# Altium schematic sheet Sheet1.SchDoc
size 420 x 297 mm; Scale: None
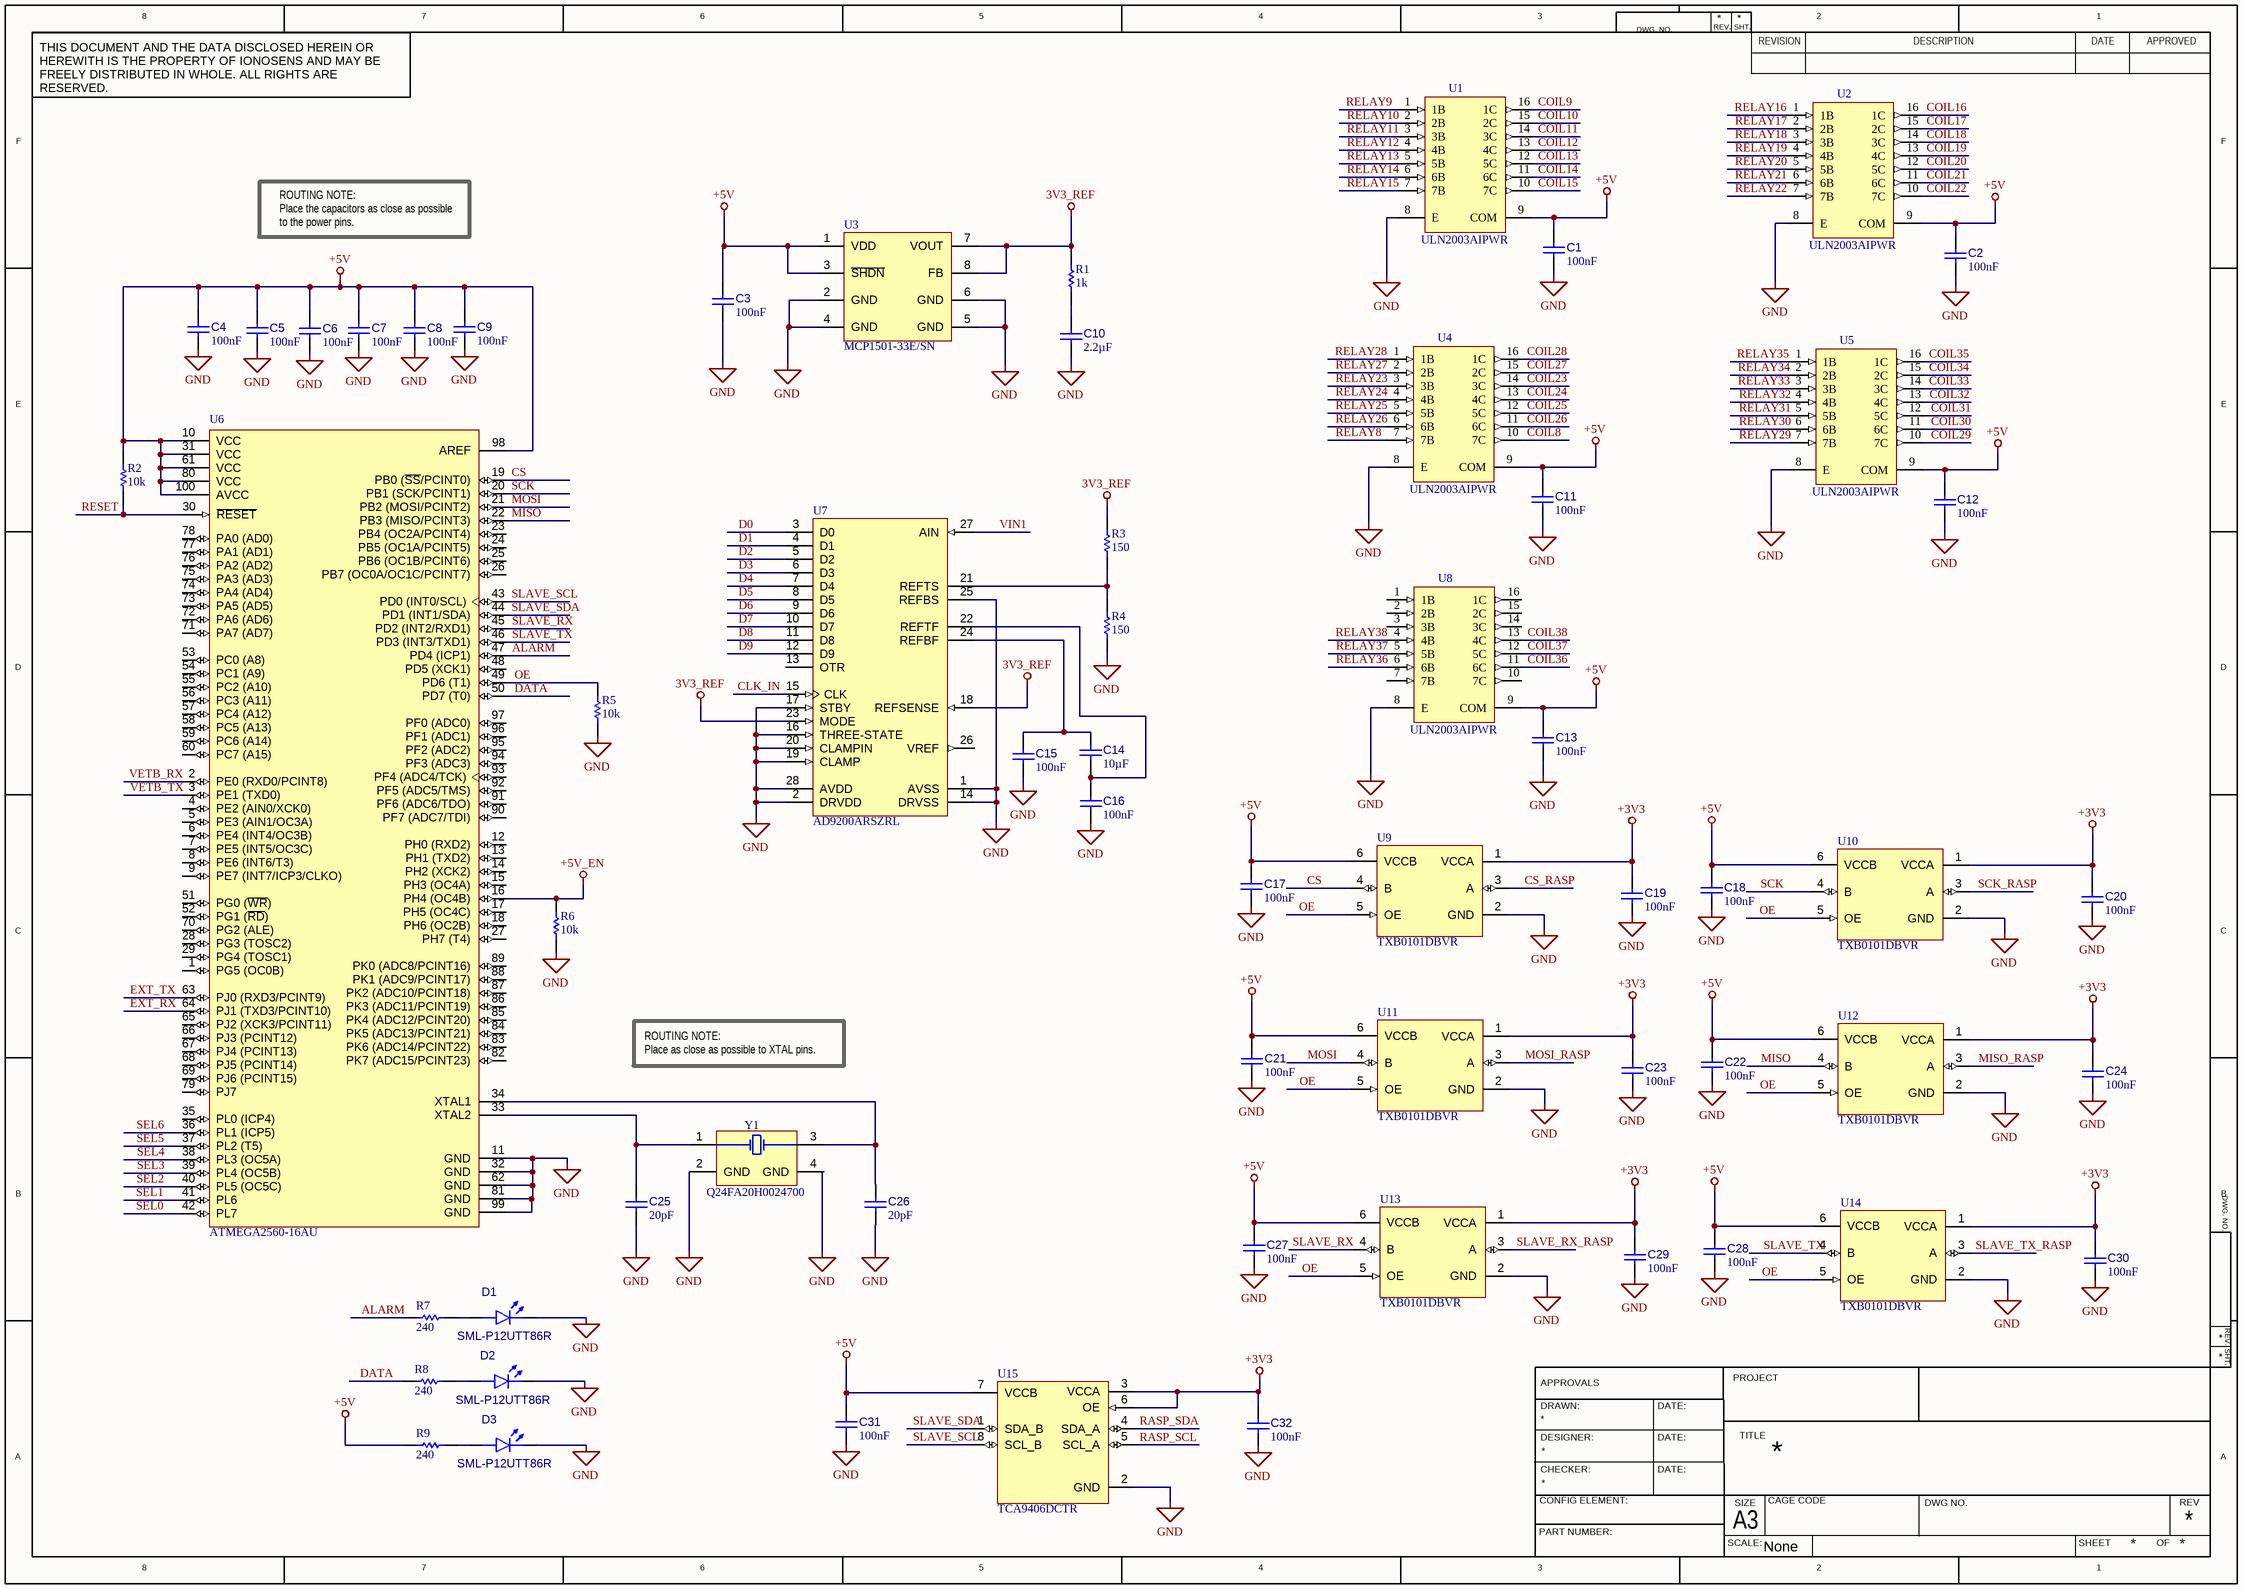
[diagram p0: Sheet1.SchDoc]

## Parts
C1  value 100nF  [CAPC1005X06M]  (hidden comment: CC0402JRX7R7BB104)
C2  value 100nF  [CAPC1005X06M]  (hidden comment: CC0402JRX7R7BB104)
C3  value 100nF  [CAPC1005X06M]  (hidden comment: CC0402JRX7R7BB104)
C4  value 100nF  [CAPC1005X06M]  (hidden comment: CC0402JRX7R7BB104)
C5  value 100nF  [CAPC1005X06M]  (hidden comment: CC0402JRX7R7BB104)
C6  value 100nF  [CAPC1005X06M]  (hidden comment: CC0402JRX7R7BB104)
C7  value 100nF  [CAPC1005X06M]  (hidden comment: CC0402JRX7R7BB104)
C8  value 100nF  [CAPC1005X06M]  (hidden comment: CC0402JRX7R7BB104)
C9  value 100nF  [CAPC1005X06M]  (hidden comment: CC0402JRX7R7BB104)
C10  value 2.2µF  [CAPC2012X14M]  (hidden comment: AC0805KKX7R8BB225)
C11  value 100nF  [CAPC1005X06M]  (hidden comment: CC0402JRX7R7BB104)
C12  value 100nF  [CAPC1005X06M]  (hidden comment: CC0402JRX7R7BB104)
C13  value 100nF  [CAPC1005X06M]  (hidden comment: CC0402JRX7R7BB104)
C14  value 10µF  [CAPC1005X07N]  (hidden comment: CC0402MRX5R6BB106)
C15  value 100nF  [CAPC1005X06M]  (hidden comment: CC0402JRX7R7BB104)
C16  value 100nF  [CAPC1005X06M]  (hidden comment: CC0402JRX7R7BB104)
C17  value 100nF  [CAPC1005X06M]  (hidden comment: CC0402JRX7R7BB104)
C18  value 100nF  [CAPC1005X06M]  (hidden comment: CC0402JRX7R7BB104)
C19  value 100nF  [CAPC1005X06M]  (hidden comment: CC0402JRX7R7BB104)
C20  value 100nF  [CAPC1005X06M]  (hidden comment: CC0402JRX7R7BB104)
C21  value 100nF  [CAPC1005X06M]  (hidden comment: CC0402JRX7R7BB104)
C22  value 100nF  [CAPC1005X06M]  (hidden comment: CC0402JRX7R7BB104)
C23  value 100nF  [CAPC1005X06M]  (hidden comment: CC0402JRX7R7BB104)
C24  value 100nF  [CAPC1005X06M]  (hidden comment: CC0402JRX7R7BB104)
C25  value 20pF  [CAPC1005X06M]  (hidden comment: CC0402JRNPO9BN200)
C26  value 20pF  [CAPC1005X06M]  (hidden comment: CC0402JRNPO9BN200)
C27  value 100nF  [CAPC1005X06M]  (hidden comment: CC0402JRX7R7BB104)
C28  value 100nF  [CAPC1005X06M]  (hidden comment: CC0402JRX7R7BB104)
C29  value 100nF  [CAPC1005X06M]  (hidden comment: CC0402JRX7R7BB104)
C30  value 100nF  [CAPC1005X06M]  (hidden comment: CC0402JRX7R7BB104)
C31  value 100nF  [CAPC1005X06M]  (hidden comment: CC0402JRX7R7BB104)
C32  value 100nF  [CAPC1005X06M]  (hidden comment: CC0402JRX7R7BB104)
D1  SML-P12UTT86R  [DIOC1005X02R]
D2  SML-P12UTT86R  [DIOC1005X02R]
D3  SML-P12UTT86R  [DIOC1005X02R]
R1  value 1k  [RESC1005X04M]  (hidden comment: AC0402FR-071KL)
R2  value 10k  [RESC1005X04M]  (hidden comment: AC0402FR-0710KL)
R3  value 150  [RESC1608X06N]  (hidden comment: AC0603FR-07150RL)
R4  value 150  [RESC1608X06N]  (hidden comment: AC0603FR-07150RL)
R5  value 10k  [RESC1005X04M]  (hidden comment: AC0402FR-0710KL)
R6  value 10k  [RESC1005X04M]  (hidden comment: AC0402FR-0710KL)
R7  value 240  [RESC1005X04M]  (hidden comment: AC0402FR-07240RL)
R8  value 240  [RESC1005X04M]  (hidden comment: AC0402FR-07240RL)
R9  value 240  [RESC1005X04M]  (hidden comment: AC0402FR-07240RL)
U1  ULN2003AIPWR  [TSOP65P640X120-16M]
U2  ULN2003AIPWR  [TSOP65P640X120-16M]
U3  MCP1501-33E/SN  [SOIC127P600X175-8M]
U4  ULN2003AIPWR  [TSOP65P640X120-16M]
U5  ULN2003AIPWR  [TSOP65P640X120-16M]
U6  ATMEGA2560-16AU  [ATML-100A_M]
U7  AD9200ARSZRL  [SOP65P780X198-28N]
U8  ULN2003AIPWR  [TSOP65P640X120-16M]
U9  TXB0101DBVR  [SOT95P280X145-6M]
U10  TXB0101DBVR  [SOT95P280X145-6M]
U11  TXB0101DBVR  [SOT95P280X145-6M]
U12  TXB0101DBVR  [SOT95P280X145-6M]
U13  TXB0101DBVR  [SOT95P280X145-6M]
U14  TXB0101DBVR  [SOT95P280X145-6M]
U15  TCA9406DCTR  [TSOP65P400X130-8M]
Y1  Q24FA20H0024700  [FA-20H]

## Nets
3V3_REF: R1.2 R3.2 U3.7(VOUT) U3.8(FB) U7.18(REFSENSE) U7.23(MODE)
+3V3: C19.2 C20.2 C23.2 C24.2 C29.2 C30.2 C32.2 U9.1(VCCA) U10.1(VCCA) U11.1(VCCA) U12.1(VCCA) U13.1(VCCA) U14.1(VCCA) U15.3(VCCA) U15.6(OE)
+5V: C1.2 C2.2 C3.2 C4.2 C5.2 C6.2 C7.2 C8.2 C9.2 C11.2 C12.2 C13.2 C17.2 C18.2 C21.2 C22.2 C27.2 C28.2 C31.2 R2.2 R9.1 U1.9(COM) U2.9(COM) U3.1(VDD) U3.3(~{SHDN}) U4.9(COM) U5.9(COM) U6.10(VCC) U6.31(VCC) U6.61(VCC) U6.80(VCC) U6.98(AREF) U6.100(AVCC) U8.9(COM) U9.6(VCCB) U10.6(VCCB) U11.6(VCCB) U12.6(VCCB) U13.6(VCCB) U14.6(VCCB) U15.7(VCCB)
+5V_EN: R6.2 U6.16(PH4_(OC4B))
GND: C1.1 C2.1 C3.1 C4.1 C5.1 C6.1 C7.1 C8.1 C9.1 C10.1 C11.1 C12.1 C13.1 C15.1 C16.1 C17.1 C18.1 C19.1 C20.1 C21.1 C22.1 C23.1 C24.1 C25.1 C26.1 C27.1 C28.1 C29.1 C30.1 C31.1 C32.1 D1.1(K) D2.1(K) D3.1(K) R4.1 R5.1 R6.1 U1.8(E) U2.8(E) U3.2(GND) U3.4(GND) U3.5(GND) U3.6(GND) U4.8(E) U5.8(E) U6.11(GND) U6.32(GND) U6.62(GND) U6.81(GND) U6.99(GND) U7.1(AVSS) U7.2(DRVDD) U7.14(DRVSS) U7.16(THREE-STATE) U7.17(STBY) U7.19(CLAMP) U7.20(CLAMPIN) U7.25(REFBS) U7.28(AVDD) U8.8(E) U9.2(GND) U10.2(GND) U11.2(GND) U12.2(GND) U13.2(GND) U14.2(GND) U15.2(GND) Y1.2(GND) Y1.4(GND)
ALARM: R7.1 U6.47(PD4_(ICP1))
CLK_IN: U7.15(CLK)
COIL8: U4.10(7C)
COIL9: U1.16(1C)
COIL10: U1.15(2C)
COIL11: U1.14(3C)
COIL12: U1.13(4C)
COIL13: U1.12(5C)
COIL14: U1.11(6C)
COIL15: U1.10(7C)
COIL16: U2.16(1C)
COIL17: U2.15(2C)
COIL18: U2.14(3C)
COIL19: U2.13(4C)
COIL20: U2.12(5C)
COIL21: U2.11(6C)
COIL22: U2.10(7C)
COIL23: U4.14(3C)
COIL24: U4.13(4C)
COIL25: U4.12(5C)
COIL26: U4.11(6C)
COIL27: U4.15(2C)
COIL28: U4.16(1C)
COIL29: U5.10(7C)
COIL30: U5.11(6C)
COIL31: U5.12(5C)
COIL32: U5.13(4C)
COIL33: U5.14(3C)
COIL34: U5.15(2C)
COIL35: U5.16(1C)
COIL36: U8.11(6C)
COIL37: U8.12(5C)
COIL38: U8.13(4C)
CS: U6.19(PB0_(~{SS}/PCINT0)) U9.4(B)
CS_RASP: U9.3(A)
D0: U7.3(D0)
D1: U7.4(D1)
D2: U7.5(D2)
D3: U7.6(D3)
D4: U7.7(D4)
D5: U7.8(D5)
D6: U7.9(D6)
D7: U7.10(D7)
D8: U7.11(D8)
D9: U7.12(D9)
DATA: R8.1 U6.50(PD7_(T0))
EXT_RX: U6.64(PJ1_(TXD3/PCINT10))
EXT_TX: U6.63(PJ0_(RXD3/PCINT9))
MISO: U6.22(PB3_(MISO/PCINT3)) U12.4(B)
MISO_RASP: U12.3(A)
MOSI: U6.21(PB2_(MOSI/PCINT2)) U11.4(B)
MOSI_RASP: U11.3(A)
OE: R5.2 U6.49(PD6_(T1)) U9.5(OE) U10.5(OE) U11.5(OE) U12.5(OE) U13.5(OE) U14.5(OE)
RASP_SCL: U15.5(SCL_A)
RASP_SDA: U15.4(SDA_A)
RELAY8: U4.7(7B)
RELAY9: U1.1(1B)
RELAY10: U1.2(2B)
RELAY11: U1.3(3B)
RELAY12: U1.4(4B)
RELAY13: U1.5(5B)
RELAY14: U1.6(6B)
RELAY15: U1.7(7B)
RELAY16: U2.1(1B)
RELAY17: U2.2(2B)
RELAY18: U2.3(3B)
RELAY19: U2.4(4B)
RELAY20: U2.5(5B)
RELAY21: U2.6(6B)
RELAY22: U2.7(7B)
RELAY23: U4.3(3B)
RELAY24: U4.4(4B)
RELAY25: U4.5(5B)
RELAY26: U4.6(6B)
RELAY27: U4.2(2B)
RELAY28: U4.1(1B)
RELAY29: U5.7(7B)
RELAY30: U5.6(6B)
RELAY31: U5.5(5B)
RELAY32: U5.4(4B)
RELAY33: U5.3(3B)
RELAY34: U5.2(2B)
RELAY35: U5.1(1B)
RELAY36: U8.6(6B)
RELAY37: U8.5(5B)
RELAY38: U8.4(4B)
RESET: R2.1 U6.30(~{RESET})
SCK: U6.20(PB1_(SCK/PCINT1)) U10.4(B)
SCK_RASP: U10.3(A)
SEL0: U6.42(PL7)
SEL1: U6.41(PL6)
SEL2: U6.40(PL5_(OC5C))
SEL3: U6.39(PL4_(OC5B))
SEL4: U6.38(PL3_(OC5A))
SEL5: U6.37(PL2_(T5))
SEL6: U6.36(PL1_(ICP5))
SLAVE_RX: U6.45(PD2_(INT2/RXD1)) U13.4(B)
SLAVE_RX_RASP: U13.3(A)
SLAVE_SCL: U6.43(PD0_(INT0/SCL)) U15.8(SCL_B)
SLAVE_SDA: U6.44(PD1_(INT1/SDA)) U15.1(SDA_B)
SLAVE_TX: U6.46(PD3_(INT3/TXD1)) U14.4(B)
SLAVE_TX_RASP: U14.3(A)
VETB_RX: U6.2(PE0_(RXD0/PCINT8))
VETB_TX: U6.3(PE1_(TXD0))
VIN1: U7.27(AIN)
NetC10_2: C10.2 R1.1
NetC14_1: C14.1 C16.2 U7.22(REFTF)
NetC14_2: C14.2 C15.2 U7.24(REFBF)
NetC25_2: C25.2 U6.33(XTAL2) Y1.1(X1)
NetC26_2: C26.2 U6.34(XTAL1) Y1.3(X2)
NetD1_2: D1.2(A) R7.2
NetD2_2: D2.2(A) R8.2
NetD3_2: D3.2(A) R9.2
NetR3_1: R3.1 R4.2 U7.21(REFTS)

Not connected (* = marked no-connect by the designer): U6 1(PG5_(OC0B)) 4(PE2_(AIN0/XCK0)) 5(PE3_(AIN1/OC3A)) 6(PE4_(INT4/OC3B)) 7(PE5_(INT5/OC3C)) 8(PE6_(INT6/T3)) 9(PE7_(INT7/ICP3/CLKO)) 12(PH0_(RXD2)) 13(PH1_(TXD2)) 14(PH2_(XCK2)) 15(PH3_(OC4A)) 17(PH5_(OC4C)) 18(PH6_(OC2B)) 23(PB4_(OC2A/PCINT4)) 24(PB5_(OC1A/PCINT5)) 25(PB6_(OC1B/PCINT6)) 26(PB7_(OC0A/OC1C/PCINT7)) 27(PH7_(T4)) 28(PG3_(TOSC2)) 29(PG4_(TOSC1)) 35(PL0_(ICP4)) 48(PD5_(XCK1)) 51(PG0_(~{WR})) 52(PG1_(~{RD})) 53(PC0_(A8)) 54(PC1_(A9)) 55(PC2_(A10)) 56(PC3_(A11)) 57(PC4_(A12)) 58(PC5_(A13)) 59(PC6_(A14)) 60(PC7_(A15)) 65(PJ2_(XCK3/PCINT11)) 66(PJ3_(PCINT12)) 67(PJ4_(PCINT13)) 68(PJ5_(PCINT14)) 69(PJ6_(PCINT15)) 70(PG2_(ALE)) 71(PA7_(AD7)) 72(PA6_(AD6)) 73(PA5_(AD5)) 74(PA4_(AD4)) 75(PA3_(AD3)) 76(PA2_(AD2)) 77(PA1_(AD1)) 78(PA0_(AD0)) 79(PJ7) 82(PK7_(ADC15/PCINT23)) 83(PK6_(ADC14/PCINT22)) 84(PK5_(ADC13/PCINT21)) 85(PK4_(ADC12/PCINT20)) 86(PK3_(ADC11/PCINT19)) 87(PK2_(ADC10/PCINT18)) 88(PK1_(ADC9/PCINT17)) 89(PK0_(ADC8/PCINT16)) 90(PF7_(ADC7/TDI)) 91(PF6_(ADC6/TDO)) 92(PF5_(ADC5/TMS)) 93(PF4_(ADC4/TCK)) 94(PF3_(ADC3)) 95(PF2_(ADC2)) 96(PF1_(ADC1)) 97(PF0_(ADC0)); U7 13(OTR) 26(VREF); U8 1(1B) 2(2B) 3(3B) 7(7B) 10(7C) 14(3C) 15(2C) 16(1C)

## Notes on the sheet
- ROUTING NOTE:
  Place the capacitors as close as possible to the power pins.
- ROUTING NOTE:
  Place as close as possible to XTAL pins.
- 8
- 7
- 6
- 5
- 4
- 3
- DWG. NO.
- REV.
- SHT.
- REVISION
- 2
- DESCRIPTION
- DATE
- 1
- APPROVED
- THIS DOCUMENT AND THE DATA DISCLOSED HEREIN OR HEREWITH IS THE PROPERTY OF IONOSENS AND MAY BE FREELY DISTRIBUTED IN WHOLE. ALL RIGHTS ARE RESERVED.
- F
- E
- D
- C
- B
- DRAWN:
- APPROVALS
- DATE:
- PROJECT
- A
- CHECKER:
- DESIGNER:
- TITLE
- PART NUMBER:
- CONFIG ELEMENT:
- SCALE:
- A3
- SIZE
- CAGE CODE
- DWG NO.
- SHEET
- OF
- REV

## Library data of the parts
C1-C9 C11-C13 C15-C24 C27-C32 = C01-0402-01-00001-1: Cap Ceramic 100nF 50V X7R 5% SMD 0402 125°C; Manufacturer: YAGEO; Voltage Rating: 16V; Case/Package: 0402; Capacitor Type: Ceramic; Min Operating Temperature: -55°C; Width: 508µm; Length: 1mm; Tolerance: 5%; Dielectric: X7R; RoHS Compliant: Yes; Pins: 2; Composition: Ceramic; Depth: 500µm; Voltage Rating (DC): 16V; Mount: Surface Mount; Mounting Technology: Surface Mount; Termination: SMD/SMT; Manufacturer P/N: CC0402JRX7R7BB104; Thickness: 558.8µm; Max Operating Temperature: 125°C
C10 = C01-0402-01-00007-1: Cap Ceramic 2.2uF 25V X7R +-10% SMD 0805 125°C; Manufacturer: YAGEO; Tolerance: 10%; Dielectric: XR7; Max Operating Temperature: 125°C; Composition: Ceramic; Min Operating Temperature: -55°C; Thickness: 711.2µm; Depth: 1.25mm; RoHS Compliant: Yes; Width: 1.2466mm; Mounting Technology: Surface Mount; Case/Package: 0805; Termination: SMD/SMT; Voltage Rating: 25V; Pins: 2; Mount: Surface Mount; Manufacturer P/N: AC0805KKX7R8BB225; Capacitor Type: Ceramic; Length: 2mm; Voltage Rating (DC): 25V
C14 = C01-0402-01-00006-4: Cap Ceramic 10uF 10V XR5 20% SMD 0402 125°C; Manufacturer: YAGEO; Termination: SMD/SMT; RoHS Compliant: Yes; Mounting Technology: Surface Mount; Max Operating Temperature: 125°C; Capacitor Type: Ceramic; Depth: 500µm; Voltage Rating: 10V; Mount: Surface Mount; Thickness: 558.8µm; Length: 990.6µm; Min Operating Temperature: -55°C; Manufacturer P/N: CC0402MRX5R6BB106; Dielectric: XR5; Case/Package: 0402; Voltage Rating (DC): 10V; Composition: Ceramic; Width: 508µm; Tolerance: 20%; Pins: 2
C25 C26 = C01-0402-01-00008-1: Cap Ceramic 20pF 50V C0G 5% SMD 0402 125°C; Manufacturer: YAGEO; Dielectric: COG; Case/Package: 0402; Tolerance: 5%; Thickness: 558.8µm; Termination: SMD/SMT; Manufacturer P/N: CC0402JRNPO9BN200; Voltage Rating: 50V; Length: 990.6µm; Depth: 500µm; Width: 508µm; Min Operating Temperature: -55°C; Mount: Surface Mount; Voltage Rating (DC): 50V; Pins: 2; Capacitor Type: Ceramic; RoHS Compliant: Yes; Composition: Ceramic; Mounting Technology: Surface Mount; Max Operating Temperature: 125°C
D1-D3 = D01-0402-01-00001-1: Led red 0402; Manufacturer: ROHM; Number of LEDs: 1; Max Power Dissipation: 52mW; Luminous Intensity: 85 mcd; Dominant Wavelength: 620 nm; Lens Style: Rectangular, Square; Forward Current: 20 mA; Forward Voltage: 2V; Mounting Technology: SMD; Case/Package: 0402; Min Operating Temperature: -40°C; Max Operating Temperature: 85°C; Manufacturer P/N: SML-P12UTT86R; Colour: red; RoHS Compliant: Yes; Pins: 2
R1 = R01-0402-01-00029-2: RES SMD 1K OHM 1% 1/16W 0402; Manufacturer: Yageo; Power Rating: 62.5mW; Voltage Rating: 50V; Temperature Coefficient: 100 ppm/ºC; Length: 990.6µm; Case/Package: 0402; Features: Automotive AEC-Q200, Moisture Resistant; RoHS: Yes; Packaging: Tape & Reel; Min Operating Temperature: -55°C; Composition: Thick Film; Width: 508µm; Number of Terminations: 2; Tolerance: 1%; Height: 370µm; Manufacturer P/N: AC0402FR-071KL; Max Operating Temperature: 155°C
R2 R5 R6 = R01-0402-01-00169-2: RES SMD 10K OHM 1% 1/16W 0402; Manufacturer: Yageo; Temperature Coefficient: 100 ppm/ºC; Power Rating: 62.5mW; Voltage Rating: 50V; Length: 990.6µm; Height: 370µm; Min Operating Temperature: -55°C; Case/Package: 0402; Features: Automotive AEC-Q200, Moisture Resistant; Packaging: Tape & Reel; Width: 508µm; Manufacturer P/N: AC0402FR-0710KL; RoHS: Yes; Max Operating Temperature: 155°C; Tolerance: 1%; Composition: Thick Film; Number of Terminations: 2
R3 R4 = R01-0603-01-00204-3: RES SMD 150 OHM 1% 1/10W 0603; Manufacturer: Yageo; Temperature Coefficient: 100 ppm/ºC; Voltage Rating: 50V; Power Rating: 100mW; Voltage Rating1: 75V; Case/Package: 0603; Composition: Thick Film; Manufacturer P/N: AC0603FR-07150RL; Features: Automotive AEC-Q200, Moisture Resistant; Tolerance: 1%; RoHS: Yes; Packaging: Tape & Reel; Min Operating Temperature: -55°C; Number of Terminations: 2; Width: 800µm; Max Operating Temperature: 155°C; Length: 1.6002µm; Height: 550µm
R7-R9 = R01-0402-01-00437-2: RES SMD 240 OHM 1% 1/16W 0402; Manufacturer: Yageo; Temperature Coefficient: 100 ppm/ºC; Power Rating: 62.5mW; Voltage Rating: 50V; Packaging: Tape & Reel; Manufacturer P/N: AC0402FR-07240RL; Height: 370µm; Case/Package: 0402; Composition: Thick Film; Max Operating Temperature: 155°C; Number of Terminations: 2; RoHS: Yes; Min Operating Temperature: -55°C; Tolerance: 1%; Width: 508µm; Length: 990.6µm; Features: Automotive AEC-Q200, Moisture Resistant
U1 U2 U4 U5 U8 = CMP-0005-0001-00001-1: 50-V, 7-ch darlington transistor array, -40 to 105C 16-TSSOP -40 to 105; Manufacturer: Texas Instruments; Voltage Rating: 50V; Min Operating Temperature: 105°C; RoHS Compliant: yes; Pins: 16; Case/Package: TSSOP; Mounting Technology: SMD; Length: 5mm; Manufacturer P/N: ULN2003AIPWR; Height: 1.2mm; Max Operating Temperature: -40°C; Width: 4.4mm
U3 = CMP-019-00050-1: V-Ref Precision 3.3V 20mA 8-Pin SOIC; Manufacturer: Microchip; Temperature Coefficient: 50 ppm/°C; Min Supply Voltage: 1.65V; Max Supply Voltage: 5.5V; Tolerance: 0.1 %; Output Voltage: 3.3V; Min Operating Temperature: -40°C; Max Operating Temperature: 125°C; Case/Package: SOIC; Pins: 8; Output Current: 20 mA; RoHS Compliant: yes; Mounting Technology: SMD; Manufacturer P/N: MCP1501-33E/SN
U6 = U01-0007-01-00000-1: AVR ATmega Microcontroller 8-bit 16MHz 256KB FLASH TQFP100; Manufacturer: Microchip; Oscillator Type: External; Interface: I2C, SPI, UART; Minimum Supply Voltage: 4.5V; Peripherals: Brown-out Detect/Reset, POR, PWM, WDT; Number of A/D: 1 AD / 16 channels; Watchdog Timer: Yes; Number of I/O: 86; RAM Size: 8KB; Max Supply Voltage: 5.5V; Max Operating Temperature: 85°C; Manufacturer P/N: ATMEGA2560-16AU; Memory Size: 256KB; Mounting Technology: SMD; Memory Type: FLASH; Pins: 100; Height: 1.2mm; Case/Package: A; RoHS: Yes; Min Operating Temperature: -40°C; Max Frequency: 16MHz; Number of Programmable I/O: 86; Contact Plating: Tin; Core Architecture: AVR; Frequency: 16MHz; Width: 16.25mm
U7 = CMP-0015-00001-3: 1-Channel Single ADC Pipelined 20Msps 10-bit Parallel 28-Pin SSOP; Manufacturer: Analog Devices; Channels: 1; Power: 100mW; Interface: Parallel; Mounting Technology: SMD; Max Operating Temperature: 85°C; Manufacturer P/N: AD9200ARSZRL; Case/Package: SSOP; Min Operating Temperature: -40°C; RoHS Compliant: yes; Pins: 28
U9-U14 = CMP-015-00009-2: Voltage Level Translator 1-CH Bidirectional 6-Pin SOT-23; Manufacturer: Texas Instrument; Min Supply Voltage: 1.2V; Max Supply Voltage: 5.5V; Data rate: 100 Mbps; Mounting Technology: SMD; Min Operating Temperature: -40°C; Pins: 6; Max Operating Temperature: 85°C; Case/Package: SOT-23; RoHS Compliant: yes; Manufacturer P/N: TXB0101DBVR
U15 = CMP-015-00008-2: 2 BIT Bidirectional 1-MHz I2C BUS and SMBus Voltage Level Translator 8-Pin SSOP; Manufacturer: Texas Instrument; Min Supply Voltage: 1.65V; Max Supply Voltage: 5.5V; Min Operating Temperature: -40°C; Manufacturer P/N: TCA9406DCTR; RoHS Compliant: yes; Mounting Technology: SMD; Pins: 8; Case/Package: SSOP8; Max Operating Temperature: 85°C
Y1 = Y01-0001-01-00000-11: 16MHz ±10ppm 16pF 80Ω SMD-2520_4P; Manufacturer: SEIKO-EPSON; ESR: 80; RoHS Compliant: yes; Min Operating Temperature: -40°C; Load Capacitance: 16pF; Mounting Technology: SMD; Pins: 4; Case/Package: SMD-2520_4P; Max Operating Temperature: 85°C; Frequency: 16MHz; Manufacturer P/N: Q24FA20H0024700